# Altium schematic sheet Photodiode TIA.SchDoc
size A4; SheetNumber: 1; SheetTotal: 2; SPICEModelCacheDTMIEZZV: <root> / <DocumentId>DTMIEZZV</DocumentId> / </root>
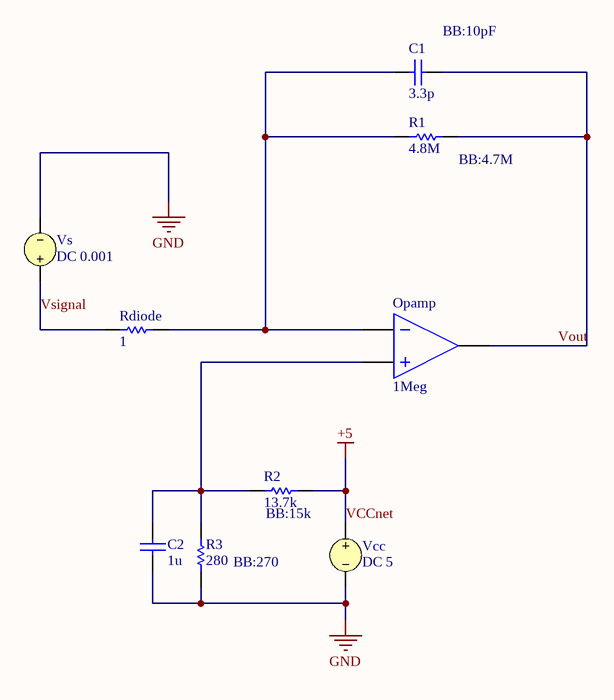
[diagram p0: Photodiode TIA.SchDoc]

## Parts
C1  value 3.3p  (hidden comment: Capacitor)
C2  value 1u  (hidden comment: Capacitor)
Opamp  GAIN: 1Meg  (hidden comment: Ideal Operational Amplifier)
R1  value 4.8M  (hidden comment: Resistor)
R2  value 13.7k  (hidden comment: Resistor)
R3  value 280  (hidden comment: Resistor)
Rdiode  value 1  (hidden comment: Resistor)
Vcc  DC 5
Vs  DC 0.001

## Nets
GND: C2.1 R3.1 Vcc.2 Vs.2
VCCnet: R2.1 Vcc.1  [also labelled +5]
Vout: C1.1 Opamp.3(OUT) R1.1
Vsignal: Rdiode.2 Vs.1
NetC1_2: C1.2 Opamp.1(IN-) R1.2 Rdiode.1
NetC2_2: C2.2 Opamp.2(IN+) R2.2 R3.2

## Notes on the sheet
- (near C1) BB:10pF
- (near R1) BB:4.7M
- (near R2) BB:15k
- (near R3) BB:270

## Library data of the parts
C1 C2 = Capacitor: SimulationGenericComponent: True
Opamp = OpAmp: SimulationGenericComponent: True
R1-R3 Rdiode = Resistor: TC1: 0; SimulationGenericComponent: True; TC2: 0
Vcc = VSRC: Voltage Source; Note: PCB Footprint - Not required; AC Magnitude: 1; AC Phase: 0; Value: 5; Published: 8-Jun-2000; LatestRevisionDate: 17-Jul-2002; LatestRevisionNote: Re-released for DXP Platform.; PackageReference: Not Applicable; Publisher: Altium Limited
Vs = VSRC: Voltage Source; Note: PCB Footprint - Not required; AC Magnitude: 0.001; AC Phase: 0; Value: 0.001; Published: 8-Jun-2000; LatestRevisionDate: 17-Jul-2002; LatestRevisionNote: Re-released for DXP Platform.; PackageReference: Not Applicable; Publisher: Altium Limited